# EAGLE schematic Guitutar_LEDS (EAGLE 8.0.0)
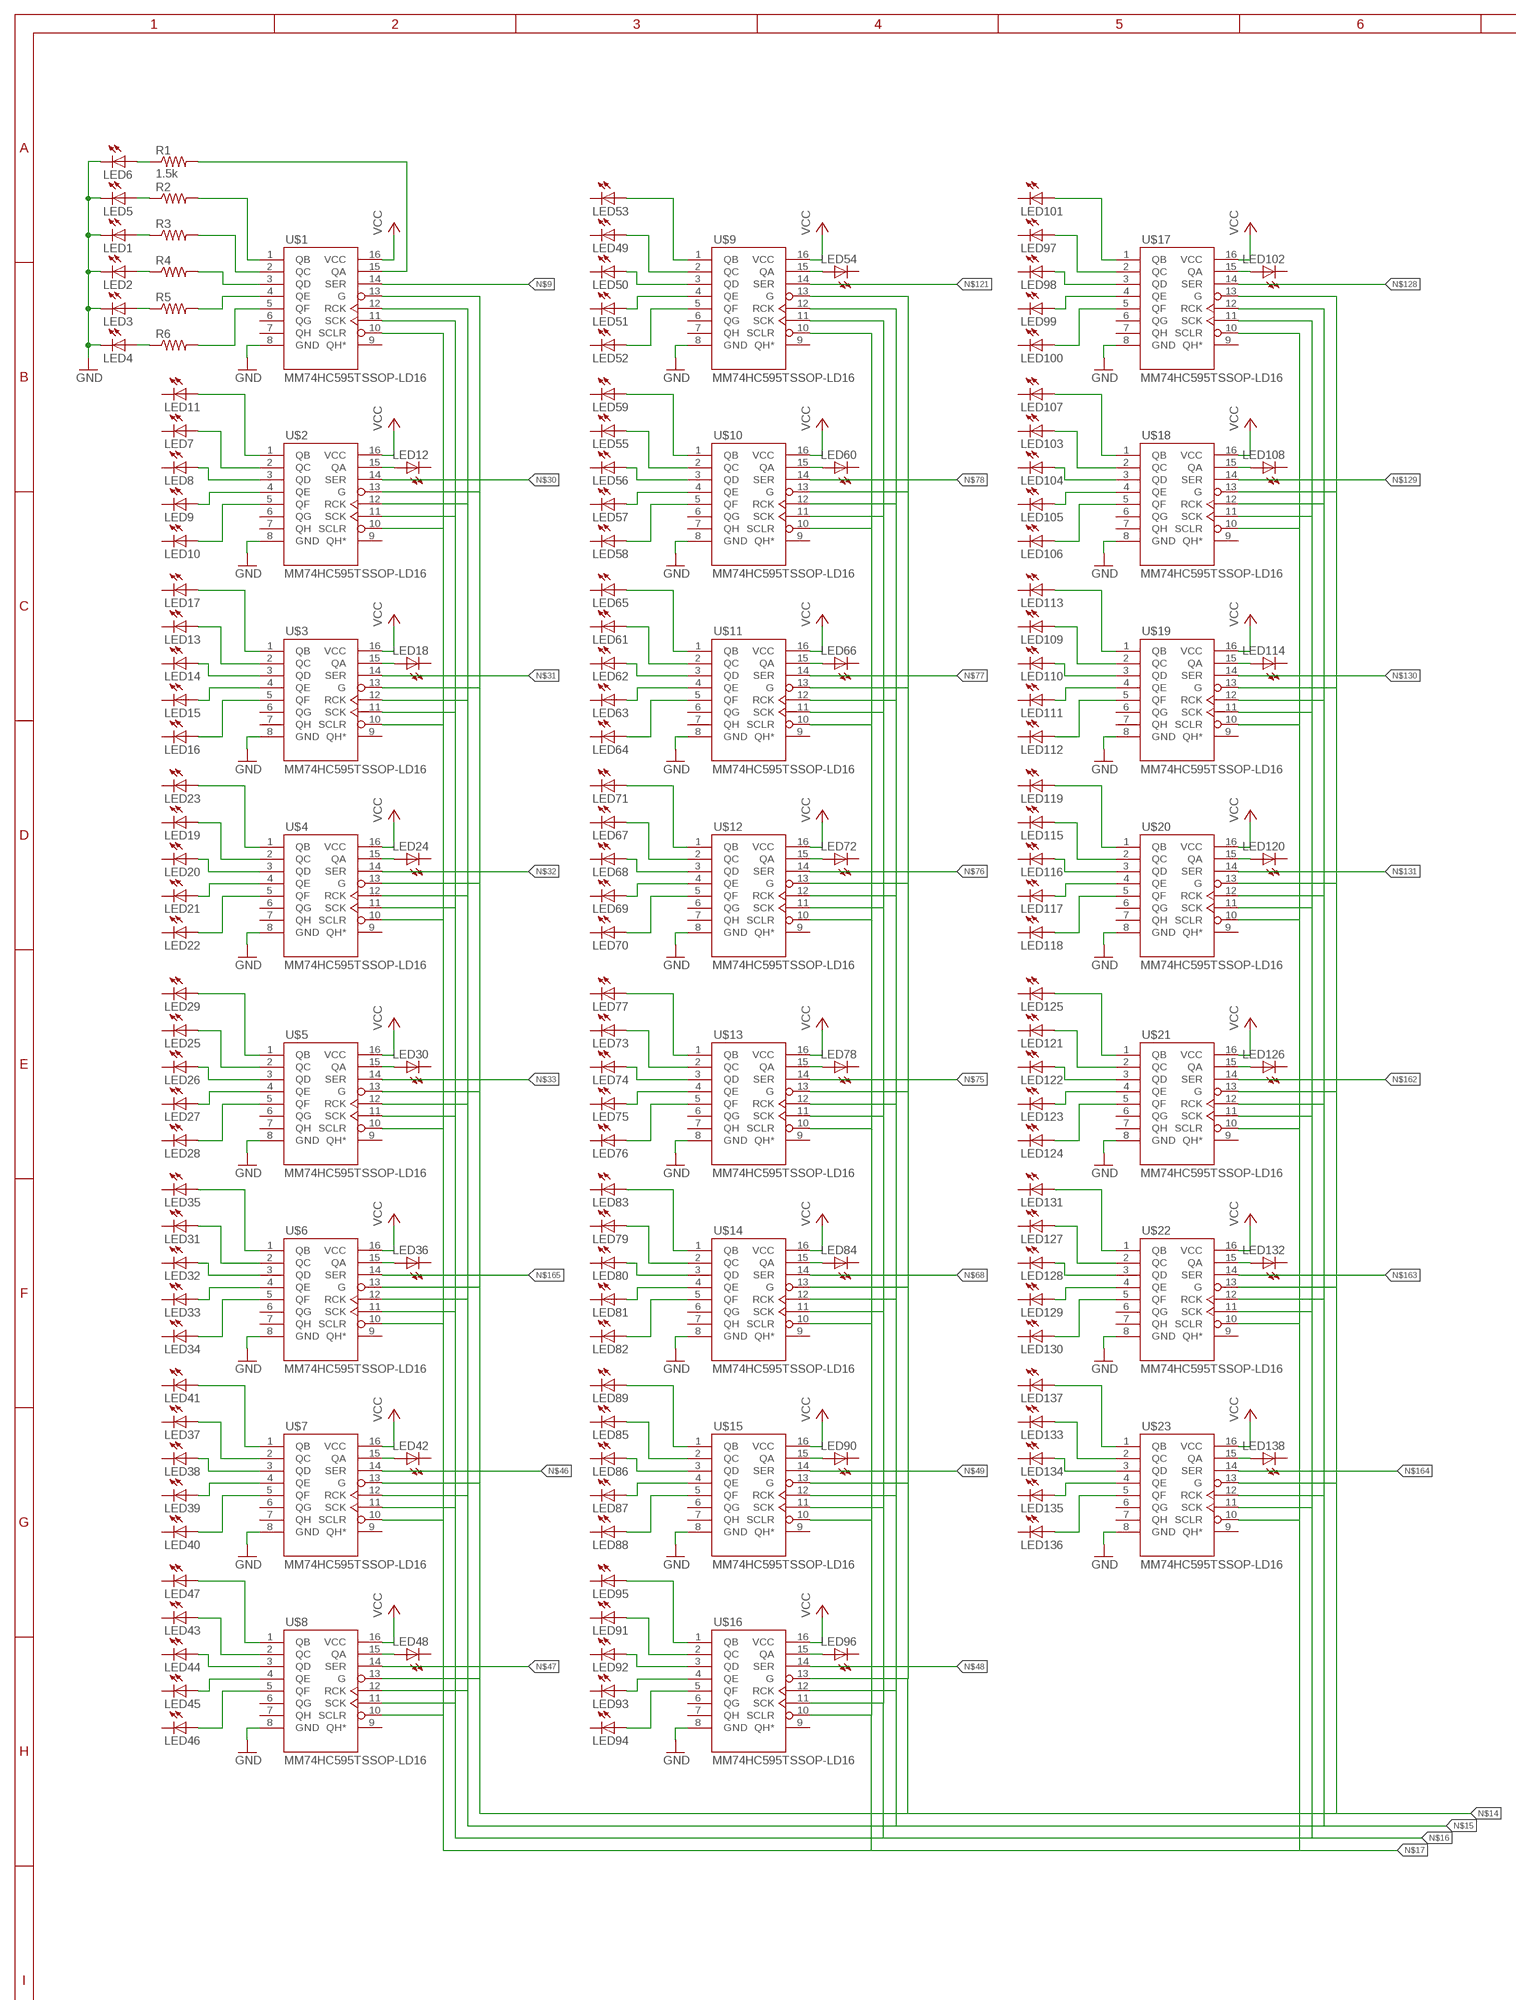
[diagram p0: schematic, sheet 1, part 1 of 2]
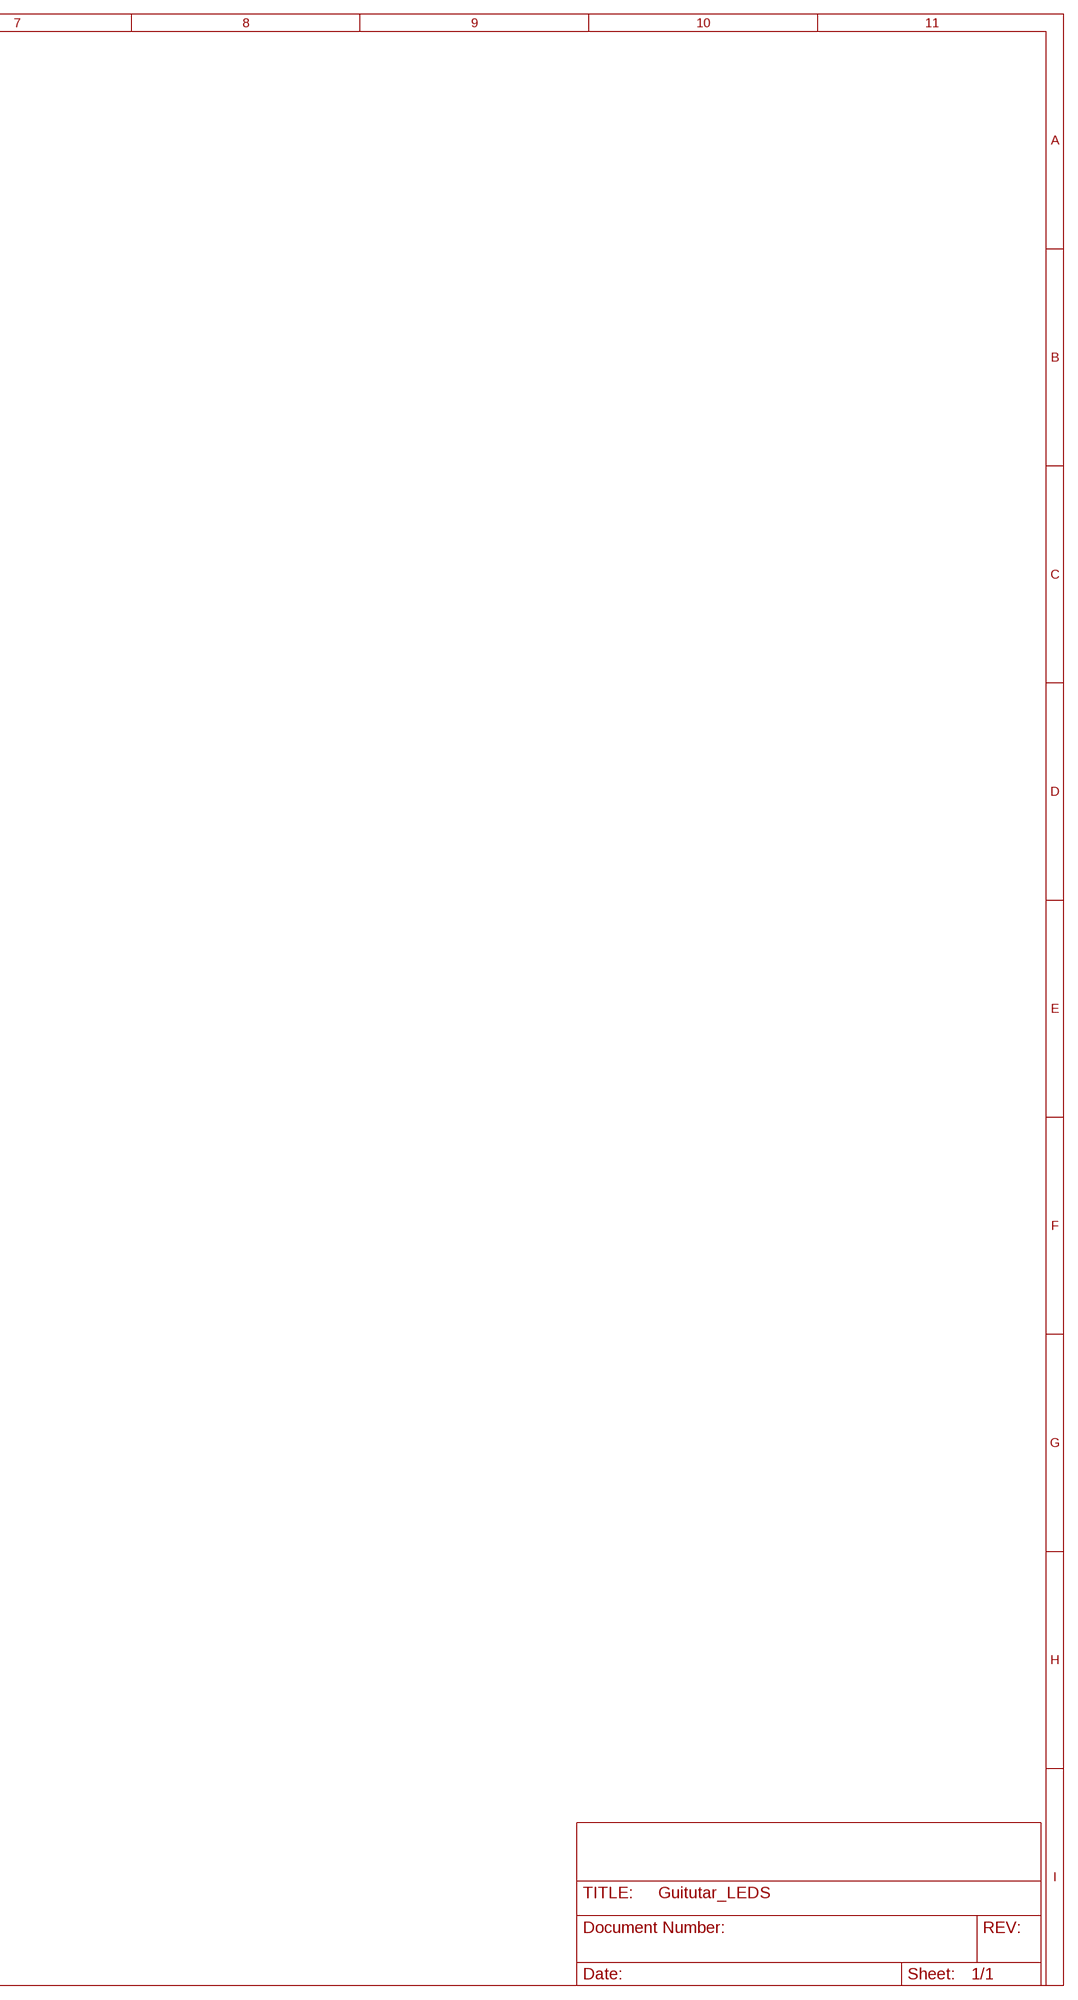
[diagram p1: schematic, sheet 1, part 2 of 2]

## Parts
LED1  LEDSMT1206  [1206]
LED2  LEDSMT1206  [1206]
LED3  LEDSMT1206  [1206]
LED4  LEDSMT1206  [1206]
LED5  LEDSMT1206  [1206]
LED6  LEDSMT1206  [1206]
LED7  LEDSMT1206  [1206]
LED8  LEDSMT1206  [1206]
LED9  LEDSMT1206  [1206]
LED10  LEDSMT1206  [1206]
LED11  LEDSMT1206  [1206]
LED12  LEDSMT1206  [1206]
LED13  LEDSMT1206  [1206]
LED14  LEDSMT1206  [1206]
LED15  LEDSMT1206  [1206]
LED16  LEDSMT1206  [1206]
LED17  LEDSMT1206  [1206]
LED18  LEDSMT1206  [1206]
LED19  LEDSMT1206  [1206]
LED20  LEDSMT1206  [1206]
LED21  LEDSMT1206  [1206]
LED22  LEDSMT1206  [1206]
LED23  LEDSMT1206  [1206]
LED24  LEDSMT1206  [1206]
LED25  LEDSMT1206  [1206]
LED26  LEDSMT1206  [1206]
LED27  LEDSMT1206  [1206]
LED28  LEDSMT1206  [1206]
LED29  LEDSMT1206  [1206]
LED30  LEDSMT1206  [1206]
LED31  LEDSMT1206  [1206]
LED32  LEDSMT1206  [1206]
LED33  LEDSMT1206  [1206]
LED34  LEDSMT1206  [1206]
LED35  LEDSMT1206  [1206]
LED36  LEDSMT1206  [1206]
LED37  LEDSMT1206  [1206]
LED38  LEDSMT1206  [1206]
LED39  LEDSMT1206  [1206]
LED40  LEDSMT1206  [1206]
LED41  LEDSMT1206  [1206]
LED42  LEDSMT1206  [1206]
LED43  LEDSMT1206  [1206]
LED44  LEDSMT1206  [1206]
LED45  LEDSMT1206  [1206]
LED46  LEDSMT1206  [1206]
LED47  LEDSMT1206  [1206]
LED48  LEDSMT1206  [1206]
LED49  LEDSMT1206  [1206]
LED50  LEDSMT1206  [1206]
LED51  LEDSMT1206  [1206]
LED52  LEDSMT1206  [1206]
LED53  LEDSMT1206  [1206]
LED54  LEDSMT1206  [1206]
LED55  LEDSMT1206  [1206]
LED56  LEDSMT1206  [1206]
LED57  LEDSMT1206  [1206]
LED58  LEDSMT1206  [1206]
LED59  LEDSMT1206  [1206]
LED60  LEDSMT1206  [1206]
LED61  LEDSMT1206  [1206]
LED62  LEDSMT1206  [1206]
LED63  LEDSMT1206  [1206]
LED64  LEDSMT1206  [1206]
LED65  LEDSMT1206  [1206]
LED66  LEDSMT1206  [1206]
LED67  LEDSMT1206  [1206]
LED68  LEDSMT1206  [1206]
LED69  LEDSMT1206  [1206]
LED70  LEDSMT1206  [1206]
LED71  LEDSMT1206  [1206]
LED72  LEDSMT1206  [1206]
LED73  LEDSMT1206  [1206]
LED74  LEDSMT1206  [1206]
LED75  LEDSMT1206  [1206]
LED76  LEDSMT1206  [1206]
LED77  LEDSMT1206  [1206]
LED78  LEDSMT1206  [1206]
LED79  LEDSMT1206  [1206]
LED80  LEDSMT1206  [1206]
LED81  LEDSMT1206  [1206]
LED82  LEDSMT1206  [1206]
LED83  LEDSMT1206  [1206]
LED84  LEDSMT1206  [1206]
LED85  LEDSMT1206  [1206]
LED86  LEDSMT1206  [1206]
LED87  LEDSMT1206  [1206]
LED88  LEDSMT1206  [1206]
LED89  LEDSMT1206  [1206]
LED90  LEDSMT1206  [1206]
LED91  LEDSMT1206  [1206]
LED92  LEDSMT1206  [1206]
LED93  LEDSMT1206  [1206]
LED94  LEDSMT1206  [1206]
LED95  LEDSMT1206  [1206]
LED96  LEDSMT1206  [1206]
LED97  LEDSMT1206  [1206]
LED98  LEDSMT1206  [1206]
LED99  LEDSMT1206  [1206]
LED100  LEDSMT1206  [1206]
LED101  LEDSMT1206  [1206]
LED102  LEDSMT1206  [1206]
LED103  LEDSMT1206  [1206]
LED104  LEDSMT1206  [1206]
LED105  LEDSMT1206  [1206]
LED106  LEDSMT1206  [1206]
LED107  LEDSMT1206  [1206]
LED108  LEDSMT1206  [1206]
LED109  LEDSMT1206  [1206]
LED110  LEDSMT1206  [1206]
LED111  LEDSMT1206  [1206]
LED112  LEDSMT1206  [1206]
LED113  LEDSMT1206  [1206]
LED114  LEDSMT1206  [1206]
LED115  LEDSMT1206  [1206]
LED116  LEDSMT1206  [1206]
LED117  LEDSMT1206  [1206]
LED118  LEDSMT1206  [1206]
LED119  LEDSMT1206  [1206]
LED120  LEDSMT1206  [1206]
LED121  LEDSMT1206  [1206]
LED122  LEDSMT1206  [1206]
LED123  LEDSMT1206  [1206]
LED124  LEDSMT1206  [1206]
LED125  LEDSMT1206  [1206]
LED126  LEDSMT1206  [1206]
LED127  LEDSMT1206  [1206]
LED128  LEDSMT1206  [1206]
LED129  LEDSMT1206  [1206]
LED130  LEDSMT1206  [1206]
LED131  LEDSMT1206  [1206]
LED132  LEDSMT1206  [1206]
LED133  LEDSMT1206  [1206]
LED134  LEDSMT1206  [1206]
LED135  LEDSMT1206  [1206]
LED136  LEDSMT1206  [1206]
LED137  LEDSMT1206  [1206]
LED138  LEDSMT1206  [1206]
R1  1.5k  R-US_R0603  [R0603]
R2  R-US_R0603  [R0603]
R3  R-US_R0603  [R0603]
R4  R-US_R0603  [R0603]
R5  R-US_R0603  [R0603]
R6  R-US_R0603  [R0603]
U$1  MM74HC595TSSOP-LD16  [MM74HC595MTCXCT-ND]
U$2  MM74HC595TSSOP-LD16  [MM74HC595MTCXCT-ND]
U$3  MM74HC595TSSOP-LD16  [MM74HC595MTCXCT-ND]
U$4  MM74HC595TSSOP-LD16  [MM74HC595MTCXCT-ND]
U$5  MM74HC595TSSOP-LD16  [MM74HC595MTCXCT-ND]
U$6  MM74HC595TSSOP-LD16  [MM74HC595MTCXCT-ND]
U$7  MM74HC595TSSOP-LD16  [MM74HC595MTCXCT-ND]
U$8  MM74HC595TSSOP-LD16  [MM74HC595MTCXCT-ND]
U$9  MM74HC595TSSOP-LD16  [MM74HC595MTCXCT-ND]
U$10  MM74HC595TSSOP-LD16  [MM74HC595MTCXCT-ND]
U$11  MM74HC595TSSOP-LD16  [MM74HC595MTCXCT-ND]
U$12  MM74HC595TSSOP-LD16  [MM74HC595MTCXCT-ND]
U$13  MM74HC595TSSOP-LD16  [MM74HC595MTCXCT-ND]
U$14  MM74HC595TSSOP-LD16  [MM74HC595MTCXCT-ND]
U$15  MM74HC595TSSOP-LD16  [MM74HC595MTCXCT-ND]
U$16  MM74HC595TSSOP-LD16  [MM74HC595MTCXCT-ND]
U$17  MM74HC595TSSOP-LD16  [MM74HC595MTCXCT-ND]
U$18  MM74HC595TSSOP-LD16  [MM74HC595MTCXCT-ND]
U$19  MM74HC595TSSOP-LD16  [MM74HC595MTCXCT-ND]
U$20  MM74HC595TSSOP-LD16  [MM74HC595MTCXCT-ND]
U$21  MM74HC595TSSOP-LD16  [MM74HC595MTCXCT-ND]
U$22  MM74HC595TSSOP-LD16  [MM74HC595MTCXCT-ND]
U$23  MM74HC595TSSOP-LD16  [MM74HC595MTCXCT-ND]

## Nets
GND: LED1.C LED2.C LED3.C LED4.C LED5.C LED6.C U$1.8(GND) U$2.8(GND) U$3.8(GND) U$4.8(GND) U$5.8(GND) U$6.8(GND) U$7.8(GND) U$8.8(GND) U$9.8(GND) U$10.8(GND) U$11.8(GND) U$12.8(GND) U$13.8(GND) U$14.8(GND) U$15.8(GND) U$16.8(GND) U$17.8(GND) U$18.8(GND) U$19.8(GND) U$20.8(GND) U$21.8(GND) U$22.8(GND) U$23.8(GND)
N$1: R1.2 U$1.15(QA)
N$2: R2.2 U$1.1(QB)
N$3: R3.2 U$1.2(QC)
N$4: R4.2 U$1.3(QD)
N$5: R5.2 U$1.4(QE)
N$6: R6.2 U$1.5(QF)
N$7: LED11.A U$2.1(QB)
N$8: LED7.A U$2.2(QC)
N$9: U$1.14(SER)
N$10: LED8.A U$2.3(QD)
N$11: LED9.A U$2.4(QE)
N$12: LED10.A U$2.5(QF)
N$13: LED12.A U$2.15(QA)
N$14: U$1.13(G) U$2.13(G) U$3.13(G) U$4.13(G) U$5.13(G) U$6.13(G) U$7.13(G) U$8.13(G) U$9.13(G) U$10.13(G) U$11.13(G) U$12.13(G) U$13.13(G) U$14.13(G) U$15.13(G) U$16.13(G) U$17.13(G) U$18.13(G) U$19.13(G) U$20.13(G) U$21.13(G) U$22.13(G) U$23.13(G)
N$15: U$1.12(RCK) U$2.12(RCK) U$3.12(RCK) U$4.12(RCK) U$5.12(RCK) U$6.12(RCK) U$7.12(RCK) U$8.12(RCK) U$9.12(RCK) U$10.12(RCK) U$11.12(RCK) U$12.12(RCK) U$13.12(RCK) U$14.12(RCK) U$15.12(RCK) U$16.12(RCK) U$17.12(RCK) U$18.12(RCK) U$19.12(RCK) U$20.12(RCK) U$21.12(RCK) U$22.12(RCK) U$23.12(RCK)
N$16: U$1.11(SCK) U$2.11(SCK) U$3.11(SCK) U$4.11(SCK) U$5.11(SCK) U$6.11(SCK) U$7.11(SCK) U$8.11(SCK) U$9.11(SCK) U$10.11(SCK) U$11.11(SCK) U$12.11(SCK) U$13.11(SCK) U$14.11(SCK) U$15.11(SCK) U$16.11(SCK) U$17.11(SCK) U$18.11(SCK) U$19.11(SCK) U$20.11(SCK) U$21.11(SCK) U$22.11(SCK) U$23.11(SCK)
N$17: U$1.10(SCLR) U$2.10(SCLR) U$3.10(SCLR) U$4.10(SCLR) U$5.10(SCLR) U$6.10(SCLR) U$7.10(SCLR) U$8.10(SCLR) U$9.10(SCLR) U$10.10(SCLR) U$11.10(SCLR) U$12.10(SCLR) U$13.10(SCLR) U$14.10(SCLR) U$15.10(SCLR) U$16.10(SCLR) U$17.10(SCLR) U$18.10(SCLR) U$19.10(SCLR) U$20.10(SCLR) U$21.10(SCLR) U$22.10(SCLR) U$23.10(SCLR)
N$18: LED17.A U$3.1(QB)
N$19: LED13.A U$3.2(QC)
N$20: LED14.A U$3.3(QD)
N$21: LED15.A U$3.4(QE)
N$22: LED16.A U$3.5(QF)
N$23: LED18.A U$3.15(QA)
N$24: LED23.A U$4.1(QB)
N$25: LED19.A U$4.2(QC)
N$26: LED20.A U$4.3(QD)
N$27: LED21.A U$4.4(QE)
N$28: LED22.A U$4.5(QF)
N$29: LED24.A U$4.15(QA)
N$30: U$2.14(SER)
N$31: U$3.14(SER)
N$32: U$4.14(SER)
N$33: U$5.14(SER)
N$34: LED29.A U$5.1(QB)
N$35: LED25.A U$5.2(QC)
N$36: LED26.A U$5.3(QD)
N$37: LED27.A U$5.4(QE)
N$38: LED28.A U$5.5(QF)
N$39: LED30.A U$5.15(QA)
N$40: LED35.A U$6.1(QB)
N$41: LED31.A U$6.2(QC)
N$42: LED32.A U$6.3(QD)
N$43: LED33.A U$6.4(QE)
N$44: LED34.A U$6.5(QF)
N$45: LED36.A U$6.15(QA)
N$46: U$7.14(SER)
N$47: U$8.14(SER)
N$48: U$16.14(SER)
N$49: U$15.14(SER)
N$50: LED41.A U$7.1(QB)
N$51: LED37.A U$7.2(QC)
N$52: LED38.A U$7.3(QD)
N$53: LED39.A U$7.4(QE)
N$54: LED40.A U$7.5(QF)
N$55: LED42.A U$7.15(QA)
N$56: LED47.A U$8.1(QB)
N$57: LED43.A U$8.2(QC)
N$58: LED44.A U$8.3(QD)
N$59: LED45.A U$8.4(QE)
N$60: LED46.A U$8.5(QF)
N$61: LED48.A U$8.15(QA)
N$62: LED53.A U$9.1(QB)
N$63: LED49.A U$9.2(QC)
N$64: LED50.A U$9.3(QD)
N$65: LED51.A U$9.4(QE)
N$66: LED52.A U$9.5(QF)
N$67: LED54.A U$9.15(QA)
N$68: U$14.14(SER)
N$69: LED59.A U$10.1(QB)
N$70: LED55.A U$10.2(QC)
N$71: LED56.A U$10.3(QD)
N$72: LED57.A U$10.4(QE)
N$73: LED58.A U$10.5(QF)
N$74: LED60.A U$10.15(QA)
N$75: U$13.14(SER)
N$76: U$12.14(SER)
N$77: U$11.14(SER)
N$78: U$10.14(SER)
N$79: LED65.A U$11.1(QB)
N$80: LED61.A U$11.2(QC)
N$81: LED62.A U$11.3(QD)
N$82: LED63.A U$11.4(QE)
N$83: LED64.A U$11.5(QF)
N$84: LED66.A U$11.15(QA)
N$85: LED71.A U$12.1(QB)
N$86: LED67.A U$12.2(QC)
N$87: LED68.A U$12.3(QD)
N$88: LED69.A U$12.4(QE)
N$89: LED70.A U$12.5(QF)
N$90: LED72.A U$12.15(QA)
N$91: LED77.A U$13.1(QB)
N$92: LED73.A U$13.2(QC)
N$93: LED74.A U$13.3(QD)
N$94: LED75.A U$13.4(QE)
N$95: LED76.A U$13.5(QF)
N$96: LED78.A U$13.15(QA)
N$97: LED83.A U$14.1(QB)
N$98: LED79.A U$14.2(QC)
N$99: LED80.A U$14.3(QD)
N$100: LED81.A U$14.4(QE)
N$101: LED82.A U$14.5(QF)
N$102: LED84.A U$14.15(QA)
N$103: LED89.A U$15.1(QB)
N$104: LED85.A U$15.2(QC)
N$105: LED86.A U$15.3(QD)
N$106: LED87.A U$15.4(QE)
N$107: LED88.A U$15.5(QF)
N$108: LED90.A U$15.15(QA)
N$109: LED95.A U$16.1(QB)
N$110: LED91.A U$16.2(QC)
N$111: LED92.A U$16.3(QD)
N$112: LED93.A U$16.4(QE)
N$113: LED94.A U$16.5(QF)
N$114: LED96.A U$16.15(QA)
N$115: LED101.A U$17.1(QB)
N$116: LED97.A U$17.2(QC)
N$117: LED98.A U$17.3(QD)
N$118: LED99.A U$17.4(QE)
N$119: LED100.A U$17.5(QF)
N$120: LED102.A U$17.15(QA)
N$121: U$9.14(SER)
N$122: LED107.A U$18.1(QB)
N$123: LED103.A U$18.2(QC)
N$124: LED104.A U$18.3(QD)
N$125: LED105.A U$18.4(QE)
N$126: LED106.A U$18.5(QF)
N$127: LED108.A U$18.15(QA)
N$128: U$17.14(SER)
N$129: U$18.14(SER)
N$130: U$19.14(SER)
N$131: U$20.14(SER)
N$132: LED113.A U$19.1(QB)
N$133: LED109.A U$19.2(QC)
N$134: LED110.A U$19.3(QD)
N$135: LED111.A U$19.4(QE)
N$136: LED112.A U$19.5(QF)
N$137: LED114.A U$19.15(QA)
N$138: LED119.A U$20.1(QB)
N$139: LED115.A U$20.2(QC)
N$140: LED116.A U$20.3(QD)
N$141: LED117.A U$20.4(QE)
N$142: LED118.A U$20.5(QF)
N$143: LED120.A U$20.15(QA)
N$144: LED125.A U$21.1(QB)
N$145: LED121.A U$21.2(QC)
N$146: LED122.A U$21.3(QD)
N$147: LED123.A U$21.4(QE)
N$148: LED124.A U$21.5(QF)
N$149: LED126.A U$21.15(QA)
N$150: LED131.A U$22.1(QB)
N$151: LED127.A U$22.2(QC)
N$152: LED128.A U$22.3(QD)
N$153: LED129.A U$22.4(QE)
N$154: LED130.A U$22.5(QF)
N$155: LED132.A U$22.15(QA)
N$156: LED137.A U$23.1(QB)
N$157: LED133.A U$23.2(QC)
N$158: LED134.A U$23.3(QD)
N$159: LED135.A U$23.4(QE)
N$160: LED136.A U$23.5(QF)
N$161: LED138.A U$23.15(QA)
N$162: U$21.14(SER)
N$163: U$22.14(SER)
N$164: U$23.14(SER)
N$165: U$6.14(SER)
N$166: LED6.A R1.1
N$168: LED4.A R6.1
N$169: LED3.A R5.1
N$170: LED2.A R4.1
N$171: LED1.A R3.1
N$172: LED5.A R2.1
VCC: U$1.16(VCC) U$2.16(VCC) U$3.16(VCC) U$4.16(VCC) U$5.16(VCC) U$6.16(VCC) U$7.16(VCC) U$8.16(VCC) U$9.16(VCC) U$10.16(VCC) U$11.16(VCC) U$12.16(VCC) U$13.16(VCC) U$14.16(VCC) U$15.16(VCC) U$16.16(VCC) U$17.16(VCC) U$18.16(VCC) U$19.16(VCC) U$20.16(VCC) U$21.16(VCC) U$22.16(VCC) U$23.16(VCC)
Unconnected: LED7.C LED8.C LED9.C LED10.C LED11.C LED12.C LED13.C LED14.C LED15.C LED16.C LED17.C LED18.C LED19.C LED20.C LED21.C LED22.C LED23.C LED24.C LED25.C LED26.C LED27.C LED28.C LED29.C LED30.C LED31.C LED32.C LED33.C LED34.C LED35.C LED36.C LED37.C LED38.C LED39.C LED40.C LED41.C LED42.C LED43.C LED44.C LED45.C LED46.C LED47.C LED48.C LED49.C LED50.C LED51.C LED52.C LED53.C LED54.C LED55.C LED56.C LED57.C LED58.C LED59.C LED60.C LED61.C LED62.C LED63.C LED64.C LED65.C LED66.C LED67.C LED68.C LED69.C LED70.C LED71.C LED72.C LED73.C LED74.C LED75.C LED76.C LED77.C LED78.C LED79.C LED80.C LED81.C LED82.C LED83.C LED84.C LED85.C LED86.C LED87.C LED88.C LED89.C LED90.C LED91.C LED92.C LED93.C LED94.C LED95.C LED96.C LED97.C LED98.C LED99.C LED100.C LED101.C LED102.C LED103.C LED104.C LED105.C LED106.C LED107.C LED108.C LED109.C LED110.C LED111.C LED112.C LED113.C LED114.C LED115.C LED116.C LED117.C LED118.C LED119.C LED120.C LED121.C LED122.C LED123.C LED124.C LED125.C LED126.C LED127.C LED128.C LED129.C LED130.C LED131.C LED132.C LED133.C LED134.C LED135.C LED136.C LED137.C LED138.C U$1.6(QG) U$1.7(QH) U$1.9(QH*) U$2.6(QG) U$2.7(QH) U$2.9(QH*) U$3.6(QG) U$3.7(QH) U$3.9(QH*) U$4.6(QG) U$4.7(QH) U$4.9(QH*) U$5.6(QG) U$5.7(QH) U$5.9(QH*) U$6.6(QG) U$6.7(QH) U$6.9(QH*) U$7.6(QG) U$7.7(QH) U$7.9(QH*) U$8.6(QG) U$8.7(QH) U$8.9(QH*) U$9.6(QG) U$9.7(QH) U$9.9(QH*) U$10.6(QG) U$10.7(QH) U$10.9(QH*) U$11.6(QG) U$11.7(QH) U$11.9(QH*) U$12.6(QG) U$12.7(QH) U$12.9(QH*) U$13.6(QG) U$13.7(QH) U$13.9(QH*) U$14.6(QG) U$14.7(QH) U$14.9(QH*) U$15.6(QG) U$15.7(QH) U$15.9(QH*) U$16.6(QG) U$16.7(QH) U$16.9(QH*) U$17.6(QG) U$17.7(QH) U$17.9(QH*) U$18.6(QG) U$18.7(QH) U$18.9(QH*) U$19.6(QG) U$19.7(QH) U$19.9(QH*) U$20.6(QG) U$20.7(QH) U$20.9(QH*) U$21.6(QG) U$21.7(QH) U$21.9(QH*) U$22.6(QG) U$22.7(QH) U$22.9(QH*) U$23.6(QG) U$23.7(QH) U$23.9(QH*)

## Library data of the parts
LED1-LED138 = led:LED: LED OSRAM: - CHIPLED LG R971, LG N971, LY N971, LG Q971, LY Q971, LO R971, LY R971 LH N974, LH R974 LS Q976, LO Q976, LY Q976 LO Q996 - Hyper CHIPLED LW Q18S LB Q993, LB Q99A, LB R99A - SideLED LS A670, LO A670, LY A670, LG A670, LP A670 LB A673, LV A673, LT A673, LW A673 LH A674 LY A675 LS A676, LA A676, LO A676, LY A676, LW A676 LS A679, LY A679, LG A679 - Hyper Micro SIDELED® LS Y876, LA Y876, LO Y876, LY Y876 LT Y87S - SmartLED LW L88C, LW L88S LB L89C, LB L89S, LG L890 LS L89K, LO L89K, LY L89K LS L896, LA L896, LO L896, LY L896 - TOPLED LS T670, LO T670, LY T670, LG T670, LP T670 LSG T670, LSP T670, LSY T670, LOP T670, LYG T670 LG T671, LOG T671, LSG T671 LB T673, LV T673, LT T673, LW T673 LH T674 LS T676, LA T676, LO T676, LY T676, LB T676, LH T676, LSB T676, LW T676 LB T67C, LV T67C, LT T67C, LS T67K, LO T67K, LY T67K, LW E67C LS E67B, LA E67B, LO E67B, LY E67B, LB E67C, LV E67C, LT E67C LW T67C LS T679, LY T679, LG T679 LS T770, LO T770, LY T770, LG T770, LP T770 LB T773, LV T773, LT T773, LW T773 LH T774 LS E675, LA E675, LY E675, LS T675 LS T776, LA T776, LO T776, LY T776, LB T776 LHGB T686 LT T68C, LB T68C - Hyper Mini TOPLED® LB M676 - Mini TOPLED Santana® LG M470 LS M47K, LO M47K, LY M47K Source: http://www.osram.convergy.de LUXEON: - LUMILED® LXK2-PW12-R00, LXK2-PW12-S00, LXK2-PW14-U00, LXK2-PW14-V00 LXK2-PM12-R00, LXK2-PM12-S00, LXK2-PM14-U00 LXK2-PE12-Q00, LXK2-PE12-R00, LXK2-PE12-S00, LXK2-PE14-T00, LXK2-PE14-U00 LXK2-PB12-K00, LXK2-PB12-L00, LXK2-PB12-M00, LXK2-PB14-N00, LXK2-PB14-P00, LXK2-PB14-Q00 LXK2-PR12-L00, LXK2-PR12-M00, LXK2-PR14-Q00, LXK2-PR14-R00 LXK2-PD12-Q00, LXK2-PD12-R00, LXK2-PD12-S00 LXK2-PH12-R00, LXK2-PH12-S00 LXK2-PL12-P00, LXK2-PL12-Q00, LXK2-PL12-R00 Source: www.luxeon.com KINGBRIGHT: KA-3528ASYC Source: www.kingbright.com
R1-R6 = rcl:R-US_: RESISTOR, American symbol
U$1-U$23 = ECE477_Guitutar:MM74HC595